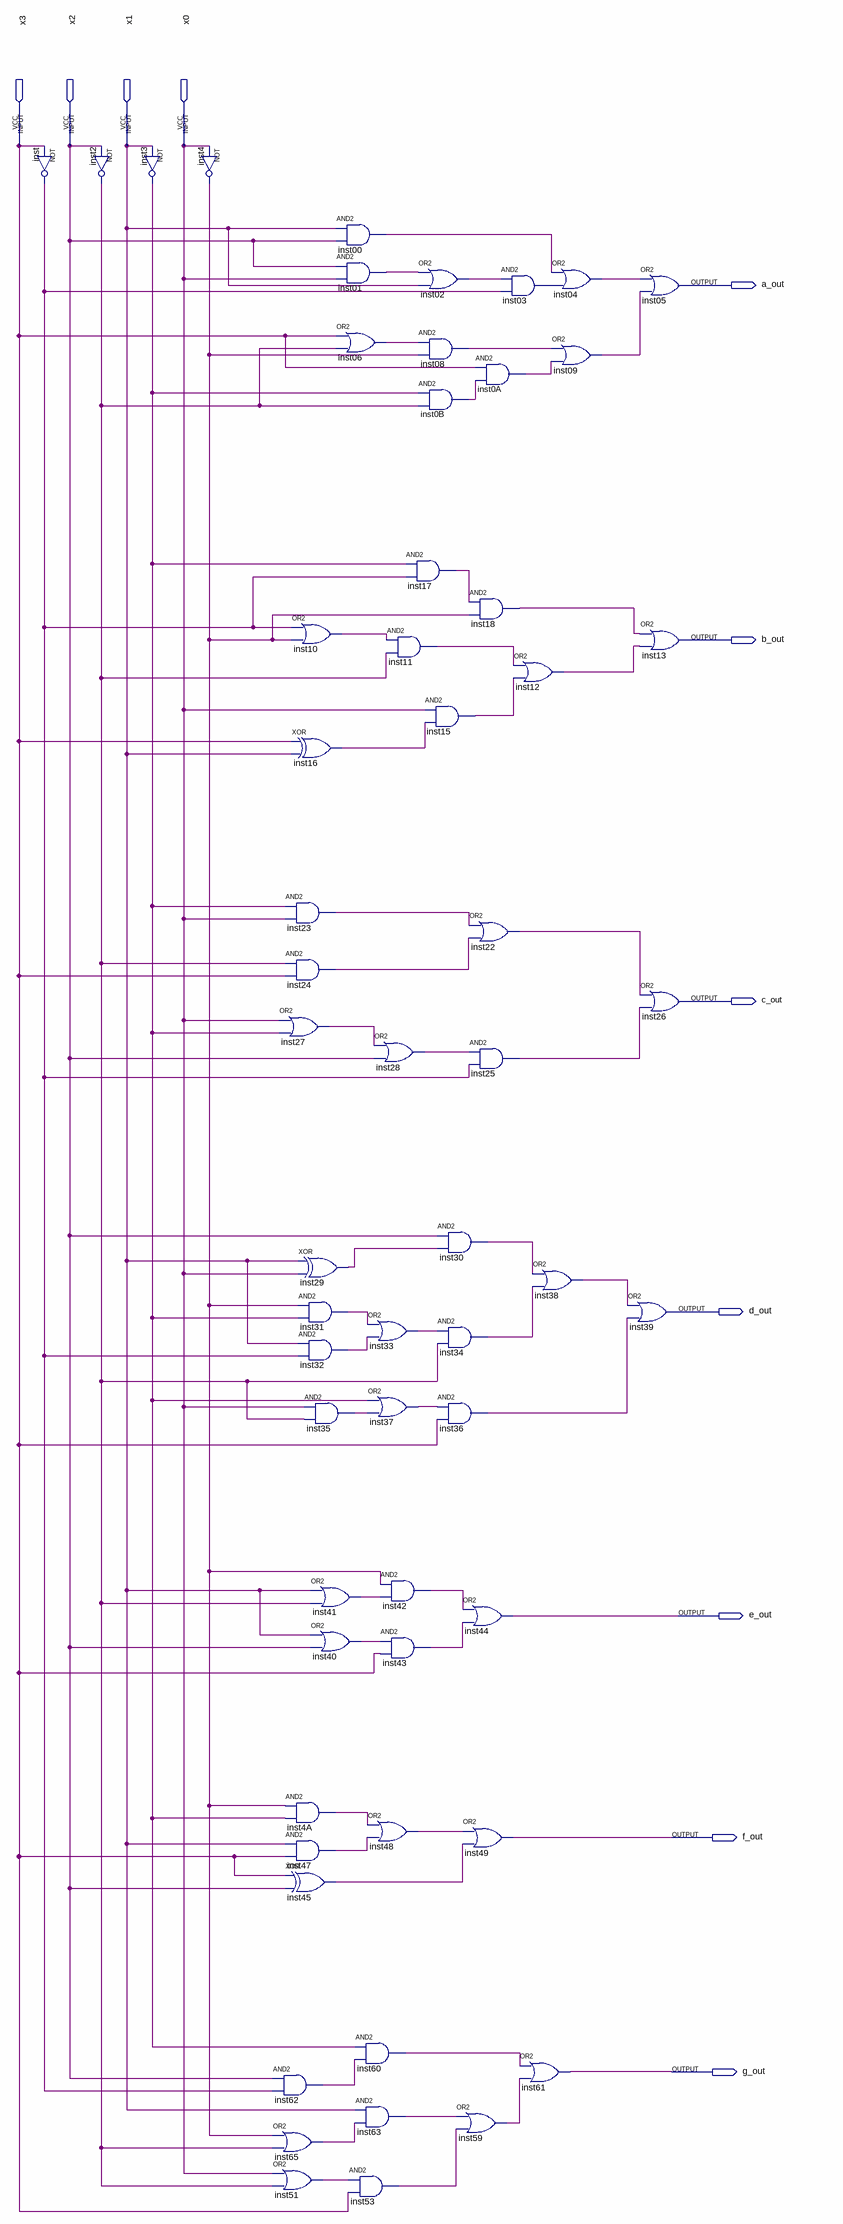
[diagram p0: schematic sheet]
// Quartus schematic sevenSegments.bdf as structural Verilog: 59 symbols, 11 pins
module sevenSegments (
  input  x3,
  input  x2,
  input  x1,
  input  x0,
  output a_out,
  output b_out,
  output c_out,
  output d_out,
  output e_out,
  output f_out,
  output g_out
);

  wire inst00_out, inst0A_out, inst0B_out, inst01_out, inst02_out, inst2_out, inst3_out, inst03_out,
       inst4_out, inst04_out, inst4A_out, inst06_out, inst08_out, inst09_out, inst10_out, inst11_out,
       inst12_out, inst15_out, inst16_out, inst17_out, inst18_out, inst22_out, inst23_out, inst24_out,
       inst25_out, inst27_out, inst28_out, inst29_out, inst30_out, inst31_out, inst32_out, inst33_out,
       inst34_out, inst35_out, inst36_out, inst37_out, inst38_out, inst40_out, inst41_out, inst42_out,
       inst43_out, inst45_out, inst47_out, inst48_out, inst51_out, inst53_out, inst59_out, inst60_out,
       inst62_out, inst63_out, inst65_out, inst_out;

  not inst (inst_out, x3);
  not inst2 (inst2_out, x2);
  not inst3 (inst3_out, x1);
  not inst4 (inst4_out, x0);
  or inst10 (inst10_out, inst_out, inst4_out);
  xor inst16 (inst16_out, x3, x1);
  and inst23 (inst23_out, inst3_out, x0);
  and inst24 (inst24_out, inst2_out, x3);
  or inst27 (inst27_out, x0, inst3_out);
  xor inst29 (inst29_out, x1, x0);
  and inst31 (inst31_out, inst4_out, inst3_out);
  and inst32 (inst32_out, x1, inst_out);
  and inst35 (inst35_out, x0, inst2_out);
  or inst41 (inst41_out, x1, inst2_out);
  or inst40 (inst40_out, x1, x2);
  and inst4A (inst4A_out, inst4_out, inst3_out);
  and inst47 (inst47_out, x1, x3);
  xor inst45 (inst45_out, x3, x2);
  and inst62 (inst62_out, x2, inst_out);
  or inst65 (inst65_out, inst4_out, inst2_out);
  or inst51 (inst51_out, x0, inst2_out);
  and inst00 (inst00_out, x1, x2);
  and inst01 (inst01_out, x2, x0);
  or inst06 (inst06_out, x3, inst2_out);
  and inst60 (inst60_out, inst3_out, inst62_out);
  and inst63 (inst63_out, x1, inst65_out);
  and inst53 (inst53_out, inst51_out, x3);
  and inst17 (inst17_out, inst3_out, inst_out);
  and inst11 (inst11_out, inst10_out, inst2_out);
  or inst28 (inst28_out, inst27_out, x2);
  or inst33 (inst33_out, inst31_out, inst32_out);
  or inst37 (inst37_out, inst3_out, inst35_out);
  and inst42 (inst42_out, inst4_out, inst41_out);
  and inst43 (inst43_out, inst40_out, x3);
  or inst48 (inst48_out, inst4A_out, inst47_out);
  or inst02 (inst02_out, inst01_out, x1);
  and inst08 (inst08_out, inst06_out, inst4_out);
  and inst0B (inst0B_out, inst3_out, inst2_out);
  and inst15 (inst15_out, x0, inst16_out);
  and inst30 (inst30_out, x2, inst29_out);
  and inst34 (inst34_out, inst33_out, inst2_out);
  and inst36 (inst36_out, inst37_out, x3);
  or inst44 (e_out, inst42_out, inst43_out);
  or inst49 (f_out, inst48_out, inst45_out);
  or inst59 (inst59_out, inst63_out, inst53_out);
  and inst03 (inst03_out, inst02_out, inst_out);
  and inst0A (inst0A_out, x3, inst0B_out);
  and inst18 (inst18_out, inst17_out, inst4_out);
  or inst12 (inst12_out, inst11_out, inst15_out);
  or inst22 (inst22_out, inst23_out, inst24_out);
  and inst25 (inst25_out, inst28_out, inst_out);
  or inst04 (inst04_out, inst00_out, inst03_out);
  or inst09 (inst09_out, inst08_out, inst0A_out);
  or inst38 (inst38_out, inst30_out, inst34_out);
  or inst61 (g_out, inst60_out, inst59_out);
  or inst05 (a_out, inst04_out, inst09_out);
  or inst13 (b_out, inst18_out, inst12_out);
  or inst26 (c_out, inst22_out, inst25_out);
  or inst39 (d_out, inst38_out, inst36_out);
endmodule
